# Altium schematic sheet РЕУН.468332.001_Step-Down_Controller.SchDoc: =Name-1str
size 840 x 594 mm; SheetNumber: 3; Вид изделия: Документация; Раздел: Документация; Код документа: Э3; Вид документа: Схема электрическая принципиальная; Класс документа: Конструкторский документ; Создавать изделие в PLM: Yes; DocumentCode: РЕУН.468332.001 Э3 2D; DocumentView: Схема электрическая принципиальная; DocumentClass: Конструкторский документ; ProductView: Документация; Format: А1
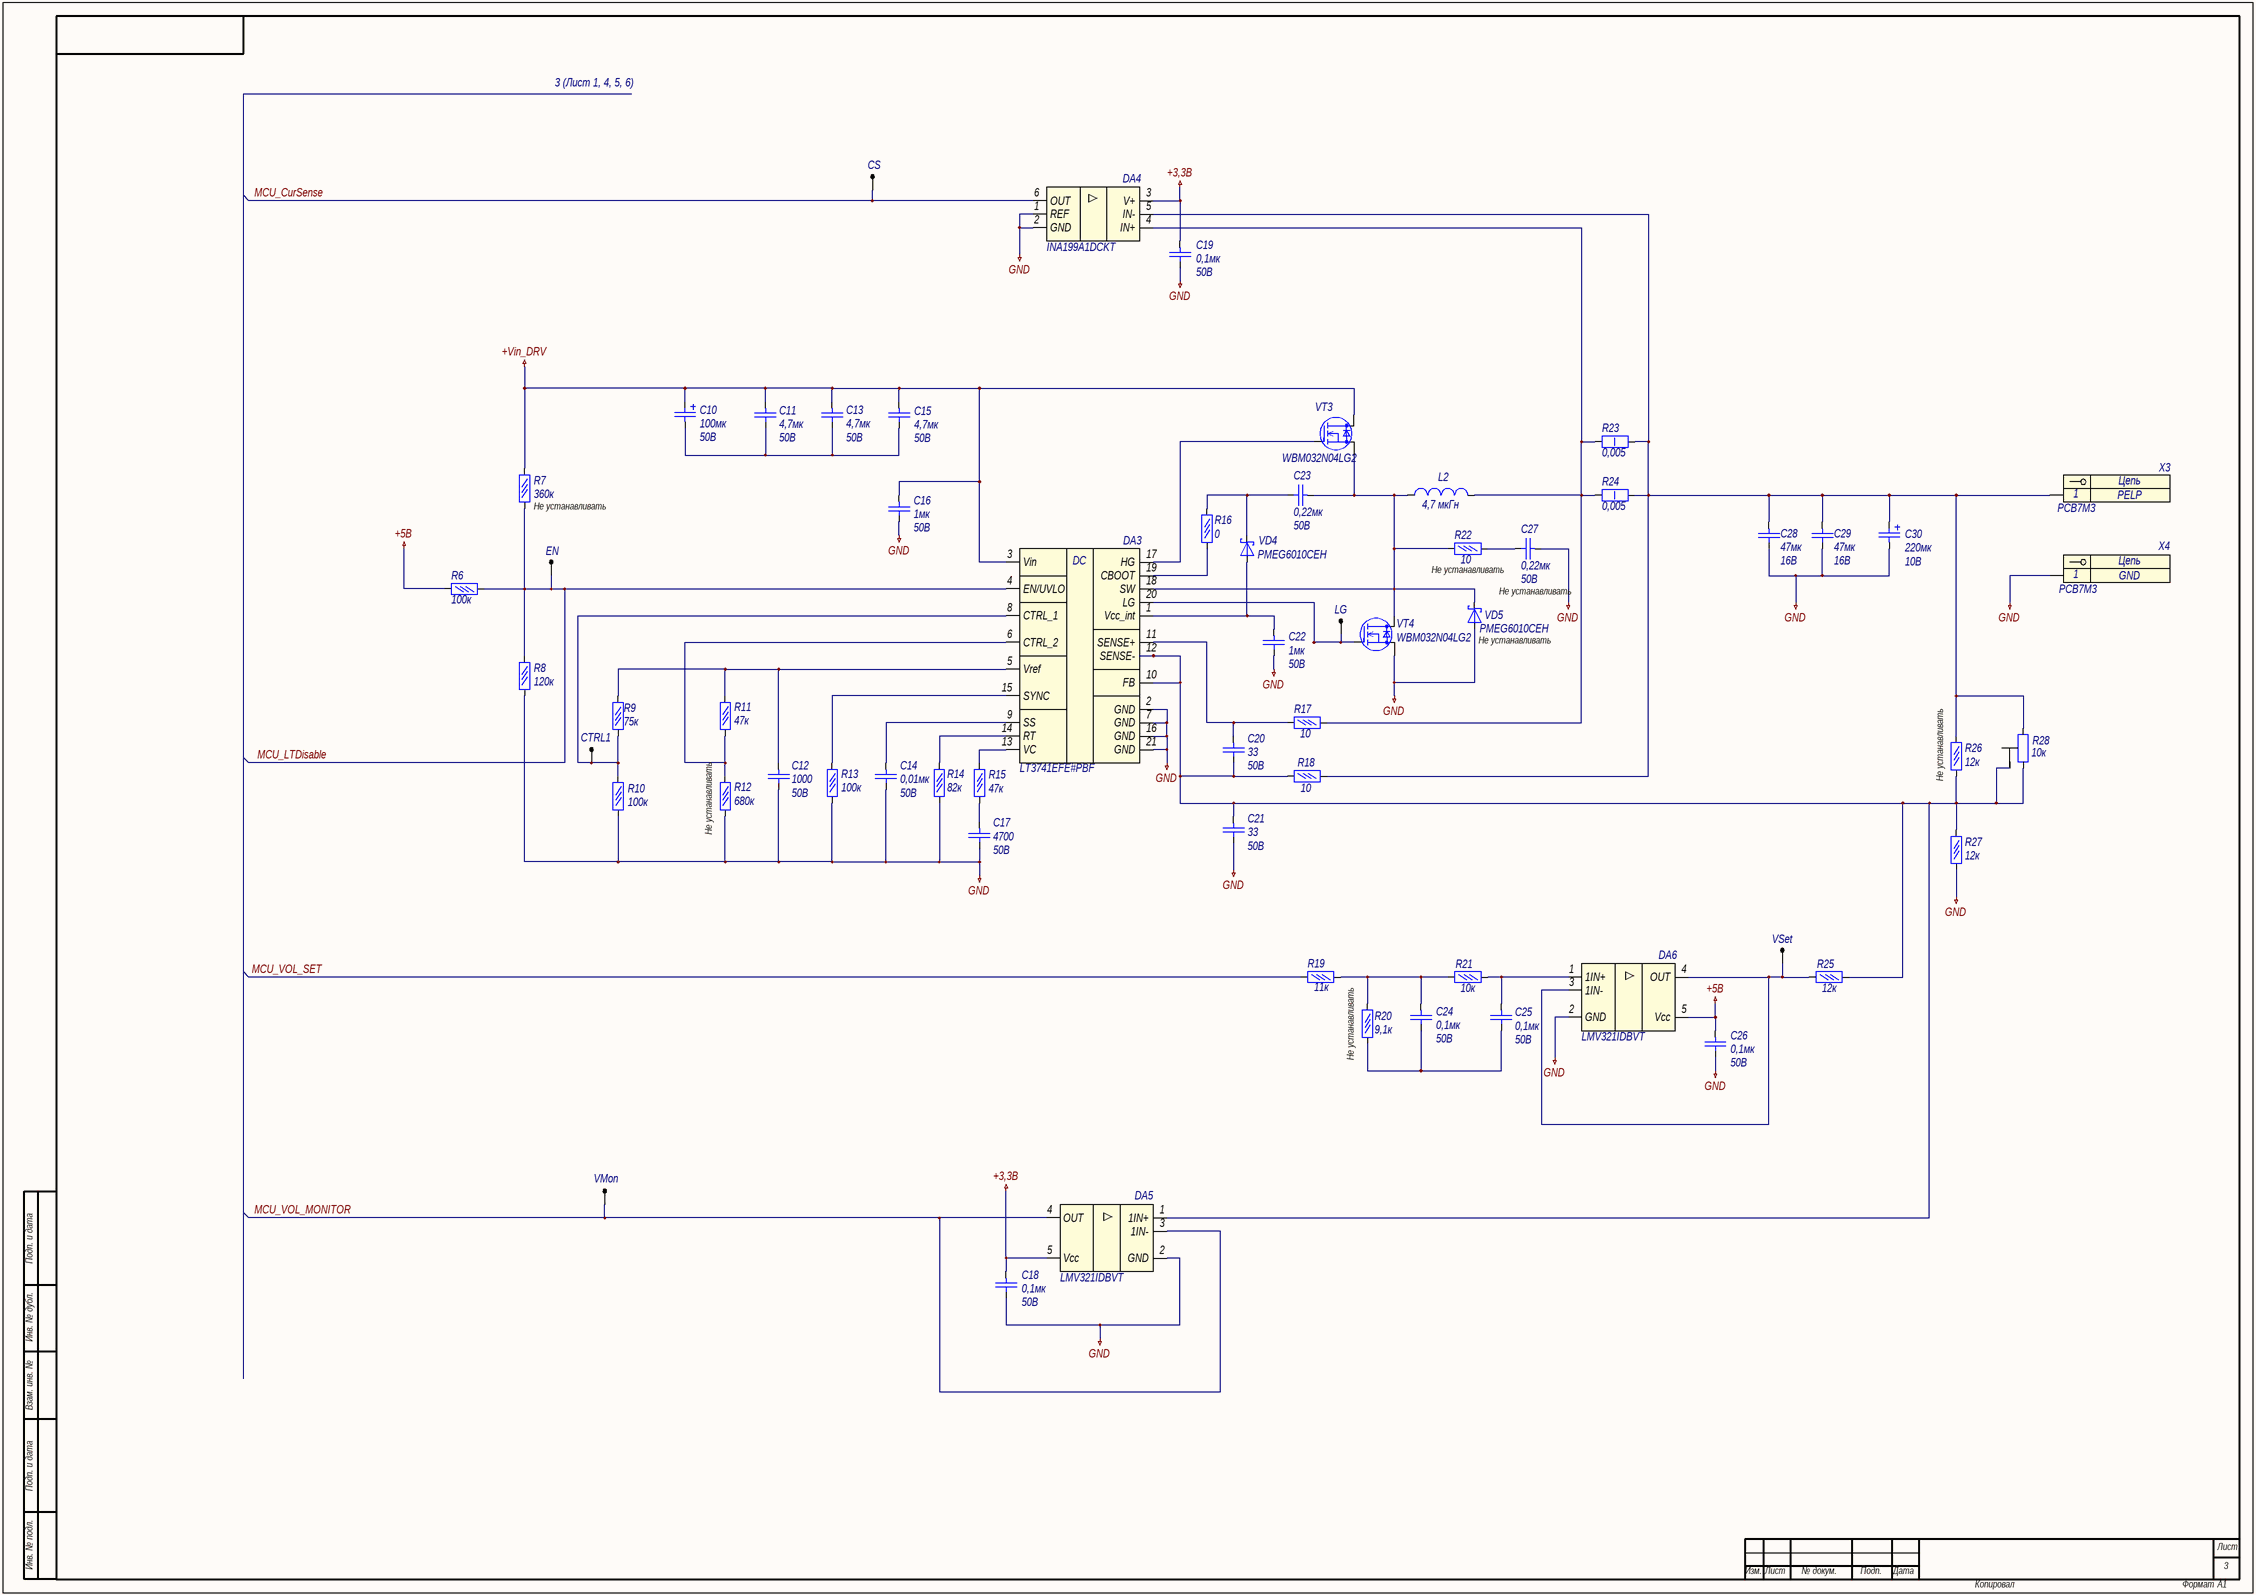
[diagram p0: РЕУН.468332.001_Step-Down_Controller.SchDoc]

## Parts
C10  Voltage: 50В  [C0805_AA]  (hidden comment: 100мк)
C11  Voltage: 50В  [C0805_AA]  (hidden comment: 4,7мк)
C12  Voltage: 50В  [C0805_AA]  (hidden comment: 1000)
C13  Voltage: 50В  [C0805_AA]  (hidden comment: 4,7мк)
C14  Voltage: 50В  [C0805_AA]  (hidden comment: 0,01мк)
C15  Voltage: 50В  [C0805_AA]  (hidden comment: 4,7мк)
C16  Voltage: 50В  [C0805_AA]  (hidden comment: 1мк)
C17  Voltage: 50В  [C0805_AA]  (hidden comment: 4700)
C18  Voltage: 50В  [C0805_AA]  (hidden comment: 0,1мк)
C19  Voltage: 50В  [C0805_AA]  (hidden comment: 0,1мк)
C20  Voltage: 50В  [C0805_AA]  (hidden comment: 33)
C21  Voltage: 50В  [C0805_AA]  (hidden comment: 33)
C22  Voltage: 50В  [C0805_AA]  (hidden comment: 1мк)
C23  Voltage: 50В  [C0805_AA]  (hidden comment: 0,22мк)
C24  Voltage: 50В  [C0805_AA]  (hidden comment: 0,1мк)
C25  Voltage: 50В  [C0805_AA]  (hidden comment: 0,1мк)
C26  Voltage: 50В  [C0805_AA]  (hidden comment: 0,1мк)
C27  Voltage: 50В  [C0805_AA]  (hidden comment: 0,22мк)
C28  Voltage: 16В  [C0805_AA]  (hidden comment: 47мк)
C29  Voltage: 16В  [C0805_AA]  (hidden comment: 47мк)
C30  Voltage: 10В  [C0805_AA]  (hidden comment: 220мк)
CS  "1"  [0.5 x 1_round]  (value not drawn)
CTRL1  "1"  [0.5 x 1_round]  (value not drawn)
DA3  LT3741EFE#PBF
DA4  INA199A1DCKT
DA5  LMV321IDBVT
DA6  LMV321IDBVT
EN  "1"  [0.5 x 1_round]  (value not drawn)
L2  4,7 мкГн  [L0603_A]
LG  "1"  [0.5 x 1_round]  (value not drawn)
R6  100к  [R1206]
R7  360к  [R1206]
R8  120к  [R1206]
R9  75к  [R1206]
R10  100к  [R1206]
R11  47к  [R1206]
R12  680к  [R1206]
R13  100к  [R1206]
R14  82к  [R1206]
R15  47к  [R1206]
R16  0  [R1206]
R17  10  [R1206]
R18  10  [R1206]
R19  11к  [R1206]
R20  9,1к  [R1206]
R21  10к  [R1206]
R22  10  [R1206]
R23  0,005  [R1206]
R24  0,005  [R1206]
R25  12к  [R1206]
R26  12к  [R1206]
R27  12к  [R1206]
R28  10к
VD4  PMEG6010CEH  [SOD123_A]
VD5  PMEG6010CEH  [SOD123_A]
VMon  "1"  [0.5 x 1_round]  (value not drawn)
VSet  "1"  [0.5 x 1_round]  (value not drawn)
VT3  WBM032N04LG2  [КТ-111В-1.02]
VT4  WBM032N04LG2  [КТ-111В-1.02]
X3  PCB7M3
X4  PCB7M3

## Nets
+3,3В: C18.2 C19.2 DA4.3(V+) DA5.5(Vcc)
+5В: C26.2 DA6.5(Vcc) R6.2
+Vin_DRV: C10.1 C11.2 C13.2 C15.2 C16.2 DA3.3(Vin) R7.2 VT3.3(D)
GND: C12.1 C14.1 C16.1 C17.1 C18.1 C19.1 C21.1 C22.1 C26.1 C27.2 C28.1 C29.1 C30.2 DA3.2(GND) DA3.7(GND) DA3.16(GND) DA3.21(GND) DA4.1(REF) DA4.2(GND) DA5.2(GND) DA6.2(GND) R8.1 R10.1 R12.1 R13.1 R14.1 R27.1 VD5.2(A) VT4.2(S) X4.1
MCU_CurSense: CS.1 DA4.6(OUT)
MCU_LTDisable: DA3.4(EN/UVLO) EN.1 R6.1 R7.1 R8.2
MCU_VOL_MONITOR: DA5.3(1IN-) DA5.4(OUT) VMon.1
MCU_VOL_SET: R19.2
NetC10_2: C10.2 C11.1 C13.1 C15.1
NetC12_2: C12.2 DA3.5(Vref) R9.1 R11.2
NetC14_2: C14.2 DA3.9(SS)
NetC17_2: C17.2 R15.1
NetC20_1: C20.1 C21.2 DA3.10(FB) DA3.12(SENSE-) DA5.1(1IN+) R18.1 R25.1 R26.1 R27.2 R28.2 R28.3
NetC20_2: C20.2 DA3.11(SENSE+) R17.1
NetC22_2: C22.2 DA3.1(Vcc_int) VD4.2(A)
NetC23_1: C23.1 R16.2 VD4.1(K)
NetC23_2: C23.2 DA3.18(SW) L2.1 R22.1 VD5.1(K) VT3.2(S) VT4.3(D)
NetC24_1: C24.1 C25.1 R20.1
NetC24_2: C24.2 R19.1 R20.2 R21.2
NetC25_2: C25.2 DA6.1(1IN+) R21.1
NetC27_1: C27.1 R22.2
NetC28_2: C28.2 C29.2 C30.1 DA4.5(IN-) R18.2 R23.2 R24.2 R26.2 R28.1 X3.1
NetCTRL1_1: CTRL1.1 DA3.8(CTRL_1) R9.2 R10.2
NetDA3_6: DA3.6(CTRL_2) R11.1 R12.2
NetDA3_13: DA3.13(VC) R15.2
NetDA3_14: DA3.14(RT) R14.2
NetDA3_15: DA3.15(SYNC) R13.2
NetDA3_17: DA3.17(HG) VT3.1(G)
NetDA3_19: DA3.19(CBOOT) R16.1
NetDA3_20: DA3.20(LG) LG.1 VT4.1(G)
NetDA4_4: DA4.4(IN+) L2.2 R17.2 R23.1 R24.1
NetDA6_3: DA6.3(1IN-) DA6.4(OUT) R25.2 VSet.1

## Notes on the sheet
- 3 (Лист 1, 4, 5, 6)
- (near R7) Не устанавливать
- Не устанавливать
- (near VD5) Не устанавливать
- (near R26) Не устанавливать
- (near R12) Не устанавливать
- Подп. и дата
- Инв. № дубл.
- Взам. инв. №
- Инв. № подл.
- Лист
- Изм.
- № докум.
- Подп.
- Дата
- Копировал
- Формат
- (in symbol LT3741) DC
- (in symbol x1-k) Цепь

## Library data of the parts
C10 = Конденсатор поляризованный: Конденсатор пол.; Name: EEHZC1H101P; Value: 100мк
C11 C13 C15 = Конденсатор кер.: Name: C1210C475K5RACTU; Value: 4,7мк
C12 = Конденсатор кер.: Name: CC0603KRX7R9BB102; Value: 1000
C14 = Конденсатор кер.: Name: CC0603KRX7R9BB103; Value: 0,01мк
C16 C22 = Конденсатор кер.: Name: 08055D105KAT2A; Value: 1мк
C17 = Конденсатор кер.: Name: CC0603KPX7R9BB472; Value: 4700
C18 C19 C24-C26 = Конденсатор кер.: Name: CC0603KRX7R9BB104; Value: 0,1мк
C20 C21 = Конденсатор кер.: Name: CC0603KRX7R9BB333; Value: 33
C23 C27 = Конденсатор кер.: Name: CC0603ZRY5V9BB224; Value: 0,22мк
C28 C29 = Конденсатор кер.: Name: C1210C476M4PACTU; Value: 47мк
C30 = Конденсатор поляризованный: Конденсатор пол.; Name: EEE-FP1A221AP; Value: 220мк
CS CTRL1 EN LG VMon VSet = TestPoint: Test point; Comment_1: "1"
DA3 = LT3741: Step-Down Controller, Constant Voltage
DA4 = INA199: Voltage output current shunt monitor
DA5 DA6 = LMV321: Операционный усилитель Rail-to-rail
L2 = Inductor: Катушка индуктивности; Name: 7443551130; Value: 4,7 мкГн
R6 R13 R14 = Резистор  0,05Вт: Резистор 0,05Вт; Name: RC0603FR-07100KL; Power rating: 0,05Вт
  R6 R13: Value: 100к
  R14: Value: 82к
R7 = Резистор  0,05Вт: Резистор 0,05Вт; Name: RC0603FR-07360KL; Power rating: 0,05Вт; Value: 360к
R8-R10 = Резистор  0,05Вт: Резистор 0,05Вт; Name: RC0603FR-07120KL; Power rating: 0,05Вт
  R8: Value: 120к
  R9: Value: 75к
  R10: Value: 100к
R11 = Резистор  0,05Вт: Резистор 0,05Вт; Name: RC0603FR-0745K3L; Power rating: 0,05Вт; Value: 47к
R12 = Резистор  0,05Вт: Резистор 0,05Вт; Name: RC0603FR-07680KL; Power rating: 0,05Вт; Value: 680к
R15 = Резистор  0,05Вт: Резистор 0,05Вт; Name: RT0603DRD0765K5L; Power rating: 0,05Вт; Value: 47к
R16 = Резистор  0,05Вт: Резистор 0,05Вт; Name: 'RC0603FR-070RL; Power rating: 0,05Вт; Value: 0
R17 R18 R22 = Резистор  0,05Вт: Резистор 0,05Вт; Name: RC0603FR-0710RL; Power rating: 0,05Вт; Value: 10
R19 = Резистор  0,05Вт: Резистор 0,05Вт; Name: RC0603FR-0711KL; Power rating: 0,05Вт; Value: 11к
R20 = Резистор  0,05Вт: Резистор 0,05Вт; Name: 'RC0603FR-079K1L; Power rating: 0,05Вт; Value: 9,1к
R21 R25 = Резистор  0,05Вт: Резистор 0,05Вт; Name: RC0603FR-0710KL; Power rating: 0,05Вт
  R21: Value: 10к
  R25: Value: 12к
R23 R24 = Резистор  1Вт: Name: WSLP25125L000JEA; Power rating: 1Вт; Value: 0,005
R26 R27 = Резистор  0,05Вт: Резистор 0,05Вт; Name: RC0603FR-0712KL; Power rating: 0,05Вт; Value: 12к
R28 = Potentiometer
VD4 VD5 = DiodeSchottky: Диод Шоттки; Name: PMEG6010CEH
VT3 VT4 = N-Mosfet: N-канальный транзистор; Vgs: *; Rds: *; Vds: *; Name: WBM032N04LG2
X3 = x1-k: Разъем - 1 конт. клемма; Contact_1: PELP; Name: PCB7M3
X4 = x1-k: Разъем - 1 конт. клемма; Contact_1: GND; Name: PCB7M3